# EAGLE design LPC_smd_display_hor (EAGLE 5.03)
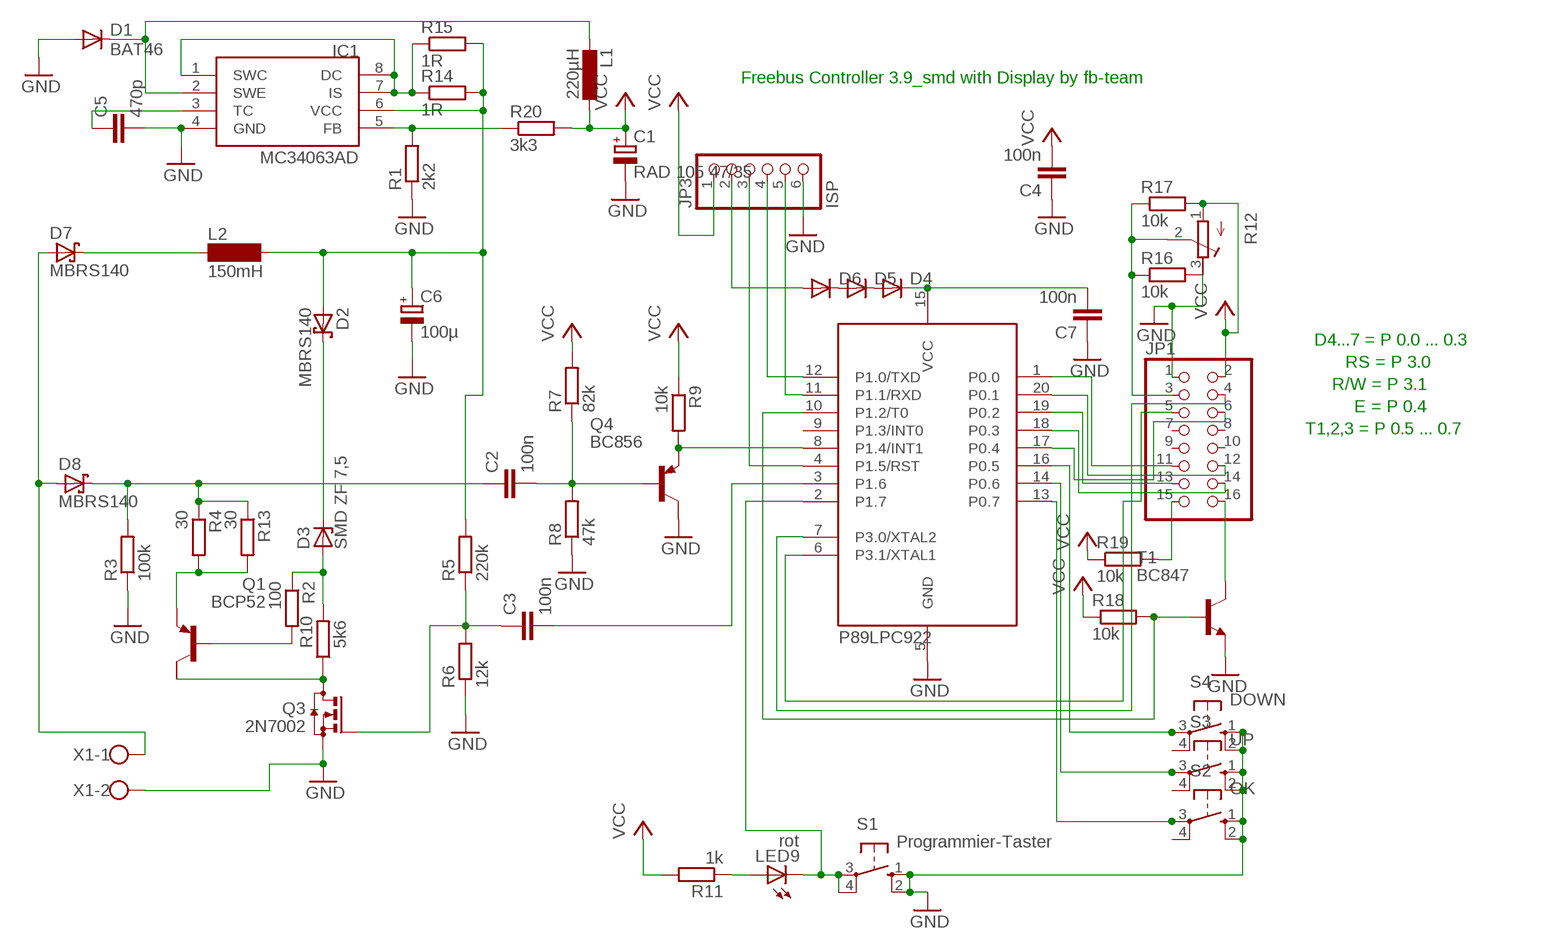
[diagram p0: schematic, sheet 1]

## Parts
C1  RAD 105 47/35  CPOL-EUE2-5  [E2-5]
C2  100n  C-EUC1206  [C1206]
C3  100n  C-EUC1206  [C1206]
C4  100n  C-EUC1206  [C1206]
C5  470p  C-EUC1206  [C1206]
C6  100µ  CPOL-EUE2.5-7  [E2,5-7]
C7  100n  C-EUC1206  [C1206]
D1  BAT46  DIODE-MINIMELF  [MINIMELF]
D2  MBRS140  MBRS130LT3  [SMB]
D3  SMD ZF 7,5  ZPD  [MINIMELF]
D4  DIODE-MINIMELF  [MINIMELF]
D5  DIODE-MINIMELF  [MINIMELF]
D6  DIODE-MINIMELF  [MINIMELF]
D7  MBRS140  MBRS130LT3  [SMB]
D8  MBRS140  MBRS130LT3  [SMB]
IC1  MC34063AD  [SOIC8]
JP1  PINHD-2X8  [2X08]
JP3  ISP  PINHD-1X6  [1X06]
L1  220µH  L-EU2200-11.43  [2200-11.43]
L2  150mH  SD12-1000  [SD12_1000]
LED9  rot  LED3MM  [LED3MM]
Q1  BCP52  FZT753SMD  [SOT223]
Q3  2N7002  BSS123  [SOT23]
Q4  BC856  BC856ALT1SMD  [SOT23-BEC]
R1  2k2  R-EU_R1206  [R1206]
R2  100  R-EU_M1206  [M1206]
R3  100k  R-EU_M1206  [M1206]
R4  30  R-EU_R1206  [R1206]
R5  220k  R-EU_R1206  [R1206]
R6  12k  R-EU_M1206  [M1206]
R7  82k  R-EU_R1206  [R1206]
R8  47k  R-EU_M1206  [M1206]
R9  10k  R-EU_R1206  [R1206]
R10  5k6  R-EU_M1206  [M1206]
R11  1k  R-EU_M1206  [M1206]
R12  R-TRIMM3374  [RTRIM3374]
R13  30  R-EU_R1206  [R1206]
R14  1R  R-EU_M1206  [M1206]
R15  1R  R-EU_M1206  [M1206]
R16  10k  R-EU_R1206  [R1206]
R17  10k  R-EU_R1206  [R1206]
R18  10k  R-EU_R1206  [R1206]
R19  10k  R-EU_R1206  [R1206]
R20  3k3  R-EU_M1206  [M1206]
S1  Programmier-Taster  10-XX  [B3F-10XX]
S2  OK  10-XX  [B3F-10XX]
S3  UP  10-XX  [B3F-10XX]
S4  DOWN  10-XX  [B3F-10XX]
T1  BC847  [SOT23]
U$1  P89LPC922_SMD  [SO20W]
X1  W237-02P  [W237-132]

## Nets
GND: C1.- C4.1 C5.2 C6.- C7.1 D1.A IC1.4(GND) JP1.1 JP3.6 Q3.2(S) Q4.C R1.1 R3.1 R6.1 R8.1 R12.3(A) R16.2 S1.1(S) S1.2(S1) S2.1(S) S2.2(S1) S3.1(S) S3.2(S1) S4.1(S) S4.2(S1) T1.2(E) U$1.5(GND) X1.2
N$1: Q4.E R9.2 U$1.8(P1.4/INT1)
N$2: C2.2 Q4.B R7.1 R8.2
N$3: IC1.5(FB) R1.2 R20.1
N$4: IC1.1(SWC) IC1.7(IS) IC1.8(DC) R14.1 R15.1
N$5: C3.2 U$1.3(P1.6)
N$6: Q1.2(C) Q3.3(D) R10.1
N$7: C6.+ D2.A IC1.6(VCC) L2.2 R5.2 R14.2 R15.2
N$8: D7.C L2.1
N$9: C2.1 D8.C R3.2 R4.1 R13.1
N$10: D1.C IC1.2(SWE) L1.2
N$11: D3.A R2.1 R10.2
N$12: Q1.3(E) R4.2 R13.2
N$13: C5.1 IC1.3(TC)
N$14: Q1.1(B) R2.2
N$15: JP1.11 U$1.1(P0.0)
N$16: D7.A D8.A X1.1
N$17: LED9.K(C) S1.3(P) S1.4(P1) U$1.2(P1.7)
N$18: JP1.12 U$1.20(P0.1)
N$19: JP1.13 U$1.19(P0.2)
N$20: JP1.3 R12.2(S) R16.1 R17.1
N$21: JP1.14 U$1.18(P0.3)
N$22: JP1.16 T1.3(C)
N$23: S4.3(P) U$1.16(P0.5)
N$24: R18.2 T1.1(B) U$1.10(P1.2/T0)
N$25: JP1.4 U$1.7(P3.0/XTAL2)
N$26: JP1.5 U$1.6(P3.1/XTAL1)
N$27: JP1.6 U$1.17(P0.4)
N$28: S3.3(P) U$1.14(P0.6)
N$29: JP3.4 U$1.12(P1.0/TXD)
N$30: JP3.5 U$1.11(P1.1/RXD)
N$31: JP3.3 U$1.4(P1.5/RST)
N$32: C7.2 D4.C U$1.15(VCC)
N$33: S2.3(P) U$1.13(P0.7)
N$34: C3.1 Q3.1(G) R5.1 R6.2
N$35: D4.A D5.C
N$36: JP1.15 R19.2
N$37: D6.A JP3.2
N$38: D5.A D6.C
N$40: D2.C D3.C
N$41: LED9.A R11.1
VCC: C1.+ C4.2 JP1.2 JP3.1 L1.1 R7.2 R9.1 R11.2 R12.1(E) R17.2 R18.1 R19.1 R20.2
Unconnected: JP1.7 JP1.8 JP1.9 JP1.10 Q1.4(C/) S2.4(P1) S3.4(P1) S4.4(P1) U$1.9(P1.3/INT0)

## Notes on the sheet
- Freebus Controller 3.9_smd with Display by fb-team
- D4...7 = P 0.0 ... 0.3
- RS = P 3.0
- R/W = P 3.1
- E = P 0.4
- T1,2,3 = P 0.5 ... 0.7
- P89LPC922

## Library data of the parts
C1 C6 = rcl:CPOL-EU: POLARIZED CAPACITOR, European symbol
C2-C5 C7 = rcl:C-EU: CAPACITOR, European symbol
D1 D4-D6 = diode:DIODE-: DIODE
D2 D7 D8 = diode:MBRS130LT3: Schottky Power Rectifier Source: http://www.onsemi.com/pub/Collateral/MBRS130LT3-D.PDF
D3 = diode:ZPD: Z DIODE 500 mW
IC1 = mc34063:MC34063
JP1 = pinhead:PINHD-2X8: PIN HEADER
JP3 = pinhead:PINHD-1X6: PIN HEADER
L1 = rcl:L-EU: INDUCTOR, European symbol
L2 = inductor-neosid:SD12: INDUCTOR nominal inductance
LED9 = led:LED: LED OSRAM: - CHIPLED LG R971, LG N971, LY N971, LG Q971, LY Q971, LO R971, LY R971 LH N974, LH R974 LS Q976, LO Q976, LY Q976 LO Q996 - Hyper CHIPLED LW Q18S LB Q993, LB Q99A, LB R99A - SideLED LS A670, LO A670, LY A670, LG A670, LP A670 LB A673, LV A673, LT A673, LW A673 LH A674 LY A675 LS A676, LA A676, LO A676, LY A676, LW A676 LS A679, LY A679, LG A679 - Hyper Micro SIDELED® LS Y876, LA Y876, LO Y876, LY Y876 LT Y87S - SmartLED LW L88C, LW L88S LB L89C, LB L89S, LG L890 LS L89K, LO L89K, LY L89K LS L896, LA L896, LO L896, LY L896 - TOPLED LS T670, LO T670, LY T670, LG T670, LP T670 LSG T670, LSP T670, LSY T670, LOP T670, LYG T670 LG T671, LOG T671, LSG T671 LB T673, LV T673, LT T673, LW T673 LH T674 LS T676, LA T676, LO T676, LY T676, LB T676, LH T676, LSB T676, LW T676 LB T67C, LV T67C, LT T67C, LS T67K, LO T67K, LY T67K, LW E67C LS E67B, LA E67B, LO E67B, LY E67B, LB E67C, LV E67C, LT E67C LW T67C LS T679, LY T679, LG T679 LS T770, LO T770, LY T770, LG T770, LP T770 LB T773, LV T773, LT T773, LW T773 LH T774 LS E675, LA E675, LY E675, LS T675 LS T776, LA T776, LO T776, LY T776, LB T776 LHGB T686 LT T68C, LB T68C - Hyper Mini TOPLED® LB M676 - Mini TOPLED Santana® LG M470 LS M47K, LO M47K, LY M47K Source: http://www.osram.convergy.de - LUMILED® LXK2-PW12-R00, LXK2-PW12-S00, LXK2-PW14-U00, LXK2-PW14-V00 LXK2-PM12-R00, LXK2-PM12-S00, LXK2-PM14-U00 LXK2-PE12-Q00, LXK2-PE12-R00, LXK2-PE12-S00, LXK2-PE14-T00, LXK2-PE14-U00 LXK2-PB12-K00, LXK2-PB12-L00, LXK2-PB12-M00, LXK2-PB14-N00, LXK2-PB14-P00, LXK2-PB14-Q00 LXK2-PR12-L00, LXK2-PR12-M00, LXK2-PR14-Q00, LXK2-PR14-R00 LXK2-PD12-Q00, LXK2-PD12-R00, LXK2-PD12-S00 LXK2-PH12-R00, LXK2-PH12-S00 LXK2-PL12-P00, LXK2-PL12-Q00, LXK2-PL12-R00 Source: www.luxeon.com
Q1 = transistor-pnp:FZT753SMD: PNP Transistor
Q3 = transistor-small-signal:BSS123: N-CHANNEL MOS FET
Q4 = transistor-pnp:BC856*: PNP Transistror
R1-R11 R13-R20 = rcl:R-EU_: RESISTOR, European symbol
R12 = rcl:R-TRIMM: Trimm resistor
S1-S4 = switch-omron:10-XX: OMRON SWITCH
T1 = transistor:BC847: NPN TRANSISTOR
U$1 = micro-philips:P89LPC922_SMD
X1 = con-wago-508:W237-02P: WAGO SREW CLAMP

## Board
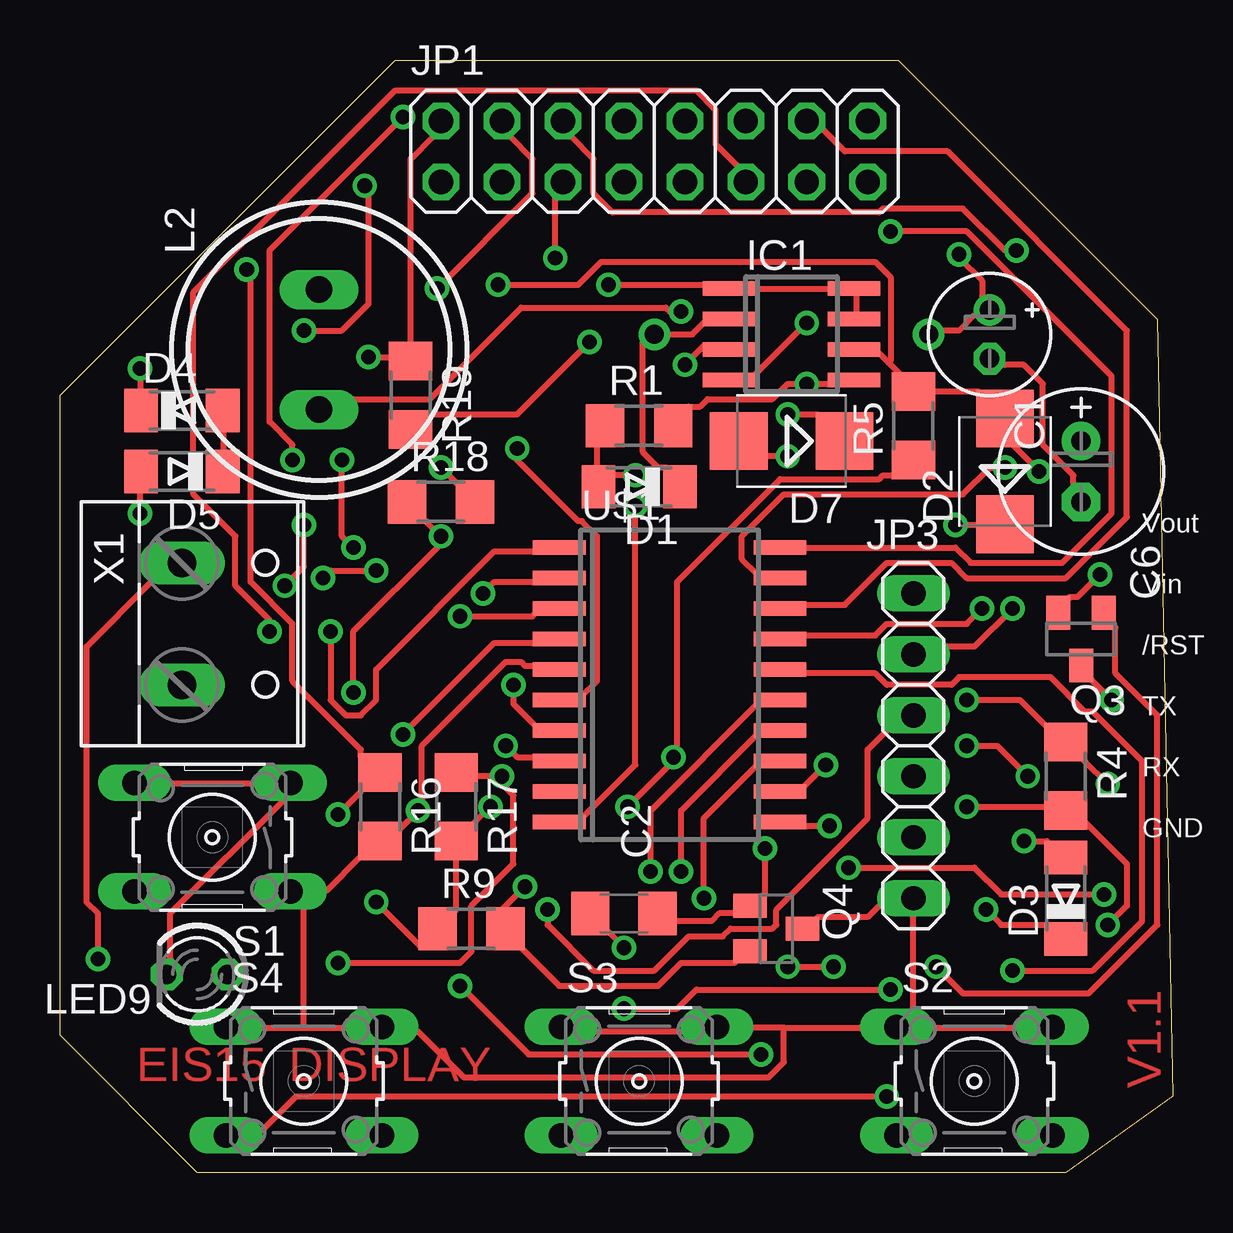
[diagram p1: board, top side]
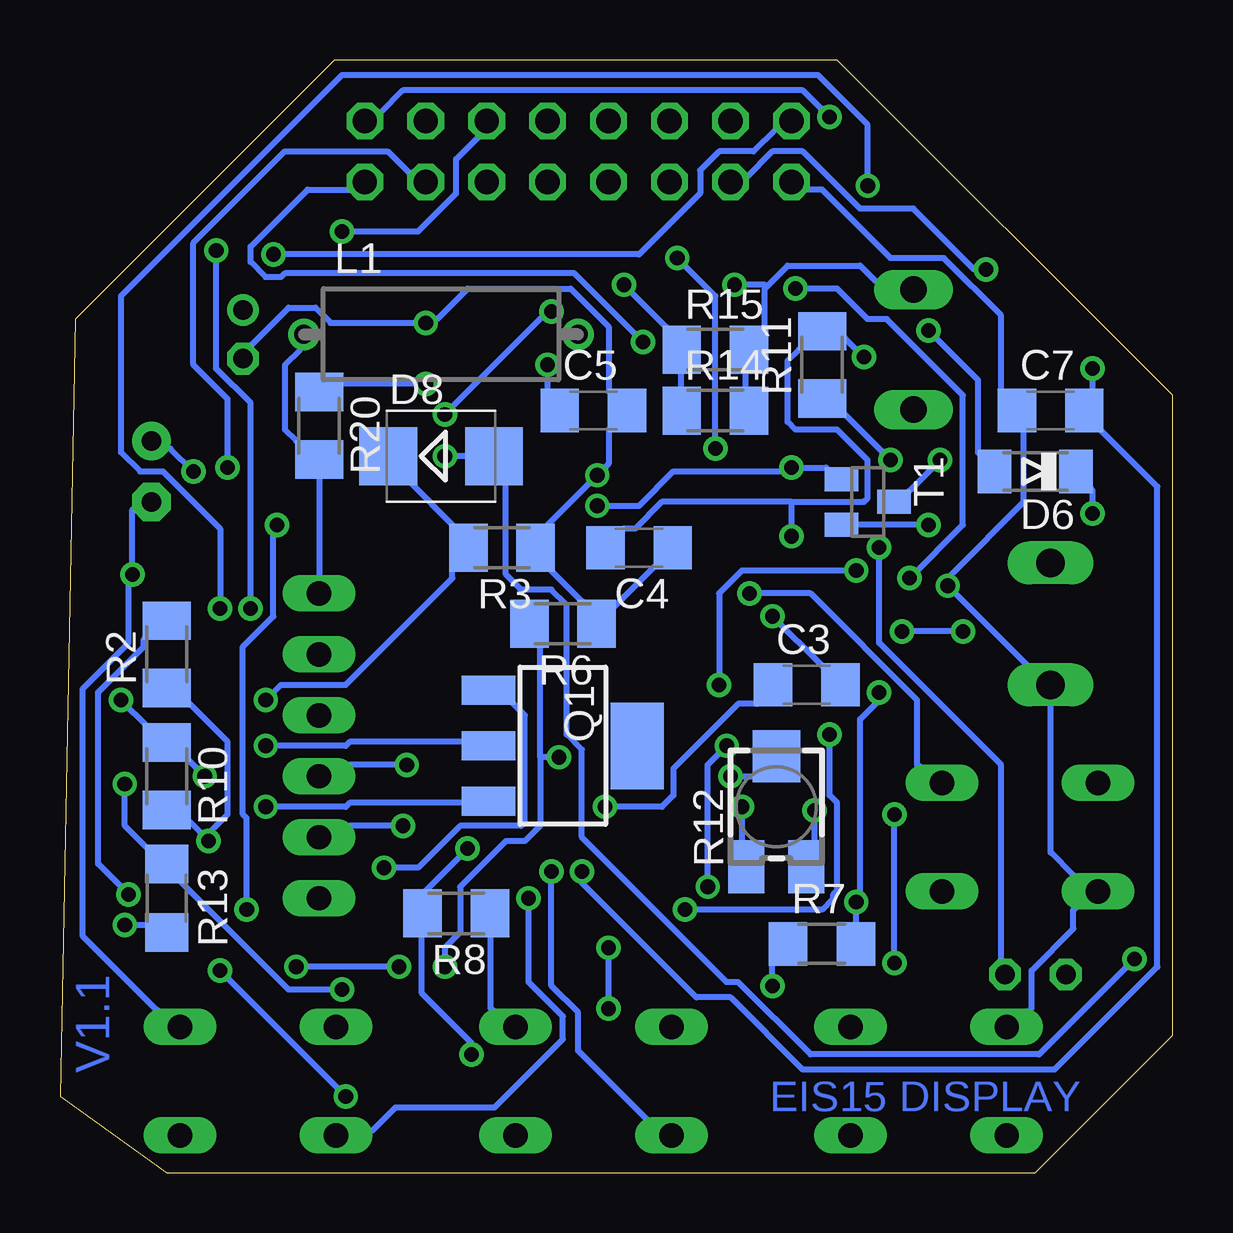
[diagram p2: board, bottom side, seen from below]

Size 46.35 x 46.36 mm. Coordinates in mm from the lower left corner, seen from the top.
Outline: 0,5.71 0,32.39 13.97,46.36 34.92,46.36 45.72,35.56 46.35,3.18 41.91,0 5.71,0 0,5.71
Copper layers (1*16): Top 0.035mm / dielectric 1.5mm / Bottom 0.035mm
Design rules "default *": minimum track width 10mil, minimum drill 24mil, track to track 10mil, track to pad 10mil, pad to pad 10mil, via to via 10mil, smd to smd 8mil, copper to edge 20mil, drill to drill 8mil, minimum pad ring 10mil, minimum via ring 8mil, stop-mask expansion 4mil, vias tented up to drill 0mil, thermal gap 10mil

### Footprints (pad centres in the part's own frame; a part is rotated, then mirrored left to right if it is on the bottom)
E2-5 = drill 0.813 pad 1.27 round: + -1.016,0 | drill 0.813 pad 1.27 octagon: - 1.016,0
C1206 = smd 1.6 x 1.8: 1 -1.4,0; 2 1.4,0
E2,5-7 = drill 0.813 pad 1.6 round: + -1.27,0 | drill 0.813 pad 1.6 octagon: - 1.27,0
MINIMELF = smd 1.4 x 1.8: A 1.7,0; C -1.7,0
SMB = smd 2.4 x 2.4: A 2.2,0; C -2.2,0
SOIC8 = smd 0.6 x 2.2: 1 -1.905,-2.6; 2 -0.635,-2.6; 3 0.635,-2.6; 4 1.905,-2.6; 5 1.905,2.6; 6 0.635,2.6; 7 -0.635,2.6; 8 -1.905,2.6
2X08 = drill 1.016 octagon: 1 -8.89,-1.27; 2 -8.89,1.27; 3 -6.35,-1.27; 4 -6.35,1.27; 5 -3.81,-1.27; 6 -3.81,1.27; 7 -1.27,-1.27; 8 -1.27,1.27; 9 1.27,-1.27; 10 1.27,1.27; 11 3.81,-1.27; 12 3.81,1.27; 13 6.35,-1.27; 14 6.35,1.27; 15 8.89,-1.27; 16 8.89,1.27
1X06 = drill 1.016 long: 1 -6.35,0; 2 -3.81,0; 3 -1.27,0; 4 1.27,0; 5 3.81,0; 6 6.35,0
2200-11.43 = drill 0.8 pad 1.27 round: 1 -5.715,0; 2 5.715,0
SD12_1000 = drill 1.1 long: 1 -2.5,0; 2 2.5,0
LED3MM = drill 0.813 octagon: A -1.27,0; K 1.27,0
SOT223 = smd 1.219 x 2.235: 1 -2.311,-3.099; 2 0,-3.099; 3 2.311,-3.099 | smd 3.6 x 2.2: 4 0,3.099
SOT23 = smd 1 x 1.4: 1 -0.95,-1.1; 2 0.95,-1.1; 3 0,1.1
SOT23-BEC = smd 1 x 1.4: B -0.95,-1.1; C 0,1.1; E 0.95,-1.1
R1206 = smd 1.6 x 1.803: 1 -1.422,0; 2 1.422,0
M1206 = smd 1.6 x 2: 1 -1.4,0; 2 1.4,0
RTRIM3374 = smd 1.5 x 2.2: 1 -1.25,-2.5; 3 1.25,-2.5 | smd 1.98 x 2.17: 2 0,2.1
B3F-10XX = drill 1.016 long: 1 -3.251,2.261; 2 3.251,2.261; 3 -3.251,-2.261; 4 3.251,-2.261
SO20W = smd 0.6 x 2.2: 1 -5.715,-4.6; 2 -4.445,-4.6; 3 -3.175,-4.6; 4 -1.905,-4.6; 5 -0.635,-4.6; 6 0.635,-4.6; 7 1.905,-4.6; 8 3.175,-4.6; 9 4.445,-4.6; 10 5.715,-4.6; 11 5.715,4.6; 12 4.445,4.6; 13 3.175,4.6; 14 1.905,4.6; 15 0.635,4.6; 16 -0.635,4.6; 17 -1.905,4.6; 18 -3.175,4.6; 19 -4.445,4.6; 20 -5.715,4.6
W237-132 = drill 1.194 long: 1 -2.54,-0.635; 2 2.54,-0.635

### Placement (x,y rotation side)
C1  38.73,34.93 270 top
C2  23.5,10.79 0 top
C3  15.24,20.32 0 bottom
C4  22.23,26.03 180 bottom
C5  24.13,31.75 0 bottom
C6  42.54,29.21 270 top
C7  5.08,31.75 0 bottom
D1  24.13,28.58 180 top
D2  39.37,29.21 90 top
D3  41.91,11.43 90 top
D4  5.08,31.75 0 top
D5  5.08,29.21 180 top
D6  5.71,29.21 180 bottom
D7  30.48,30.48 180 top
D8  30.48,29.84 0 bottom
IC1  30.48,34.93 270 top
JP1  24.77,42.55 0 top
JP3  35.56,17.78 270 top
L1  30.48,34.93 0 bottom
L2  10.79,34.29 90 top
LED9  5.71,8.26 180 top
Q1  25.4,17.78 270 bottom
Q3  42.54,22.23 180 top
Q4  29.85,10.16 270 top
R1  24.13,31.12 0 top
R2  41.91,21.59 90 bottom
R3  27.94,26.03 180 bottom
R4  41.91,16.51 270 top
R5  35.56,31.12 90 top
R6  25.4,22.86 180 bottom
R7  14.61,9.53 0 bottom
R8  29.85,10.79 180 bottom
R9  17.15,10.16 0 top
R10  41.91,16.51 270 bottom
R11  14.61,33.66 90 bottom
R12  16.51,15.24 0 bottom
R13  41.91,11.43 270 bottom
R14  19.05,31.75 0 bottom
R15  19.05,34.29 0 bottom
R16  13.33,15.24 270 top
R17  16.51,15.24 270 top
R18  15.88,27.94 0 top
R19  14.61,32.39 270 top
R20  35.56,31.12 270 bottom
S1  6.35,13.97 180 top
S2  38.1,3.81 0 top
S3  24.13,3.81 0 top
S4  10.16,3.81 0 top
T1  12.7,27.94 270 bottom
U$1  25.4,20.32 270 top
X1  5.71,22.86 270 top

### Tracks (layer width: path | path; a pad name or v marks a point on that pad's centre or on a via)
GND  (via drill 0.61)
  Top 0.254: v10.16,26.99 10.16,25.24 v9.37,24.45 | R1.1 22.38,30.32 22.38,29.37 D1.A 23.02,29.05 v23.97,29.05 | v43.34,24.92 42.39,23.97 42.07,23.97 Q3.2 | v31.12,35.4 28.89,33.18 IC1.4 | C6.- 42.23,28.73 42.23,29.05 40.96,30.32 40.96,32.86 40.16,33.66 39.37,33.66 C1.- | S3.1 22.38,5.87 25.88,5.87 S3.2 28.89,6.03 30.16,6.03 | Q4.C 31.59,10.64 33.66,10.64 34.13,11.11 JP3.6 35.56,6.83 S2.1 | S2.1 36.35,6.03 39.85,6.03 S2.2 | 30.16,6.03 33.34,6.03 S2.1 | 10.16,6.03 11.91,6.03 S4.2 14.92,5.87 16.83,3.97 29.53,3.97 30.16,4.6 30.16,6.03 | 10.16,6.03 8.41,6.03 S4.1 | U$1.5 19.84,21.11 19.37,21.11 19.21,21.27 18.57,21.27 15.08,17.78 15.08,15.56 v14.92,15.08 14.13,14.29 R16.2 12.54,13.18 11.11,11.75 S1.1 10.16,10.95 10.16,6.03
  Bottom 0.254: v10.16,26.99 13.18,26.99 T1.2 | JP1.1 15.24,40.96 14.61,40.96 11.75,38.1 9.53,38.1 7.14,35.72 7.14,32.54 C7.1 6.19,30.96 6.19,27.94 9.21,24.92 v9.37,24.45 6.03,21.11 X1.2 5.08,13.33 4.13,12.38 S1.2 4.13,10.95 4.13,10.16 5.87,8.41 5.87,6.83 S4.1 | C4.1 21.59,25.24 23.34,23.49 R6.1 24.61,23.81 25.88,25.08 R3.1 26.04,26.99 v23.97,29.05 23.5,29.53 23.5,30.96 C5.2 23.5,32.54 23.5,35.24 25.08,36.83 29.37,36.83 30.64,35.56 v31.12,35.4 35.08,35.4 35.72,36.04 36.83,36.04 38.42,34.45 C1.- | C6.- 43.34,27.62 v43.34,24.92 43.5,24.45 43.5,22.07 45.4,20.16 45.4,9.84 42.39,6.83 S2.2 | R8.1 28.42,9.84 28.42,6.83 S3.2 | v14.92,15.08 14.92,13.81 R12.3
N$1  (via drill 0.61)
  Top 0.254: Q4.E 28.1,8.73 25.88,8.73 24.92,7.78 20.8,7.78 19.21,9.37 R9.2 18.42,10.95 v19.37,11.91 | v18.57,17.78 19.05,17.3 19.84,17.3 U$1.8
  Bottom 0.254: v18.57,17.78 19.37,16.99 v19.37,11.91
N$2  (via drill 0.61)
  Top 0.254: C2.2 25.56,10.48 27.15,10.48 27.46,10.79 28.1,10.79 Q4.B 29.37,11.59 v29.37,13.49 | v16.67,7.78 19.53,4.92 v29.21,4.92
  Bottom 0.254: v16.67,7.78 16.67,8.73 R7.1 | v29.21,4.92 29.21,5.4 31.27,7.46 31.27,9.84 R8.2 31.12,11.75 v29.37,13.49
N$3  (via drill 0.61)
  Top 0.254: R1.2 26.19,31.91 26.67,31.91 26.99,32.23 29.69,32.23 30.32,32.86 v31.12,32.86 32.07,32.86 IC1.5
  Bottom 0.254: v31.12,32.86 34.61,32.86 R20.1
N$4  (via drill 0.61)
  Top 0.254: IC1.7 33.18,35.72 33.18,36.67 IC1.8 32.07,36.83 28.89,36.83 IC1.1 26.83,36.99 v22.86,36.99
  Bottom 0.254: R14.1 20.48,32.7 20.48,33.34 R15.1 21.11,35.24 v22.86,36.99
N$5  (via drill 0.61)
  Top 0.254: v16.67,23.18 19.69,23.18 19.84,23.34 U$1.3
  Bottom 0.254: v16.67,23.18 14.61,21.11 C3.2
N$6  (via drill 0.61)
  Top 0.254: v43.81,19.69 43.02,20.48 Q3.3 | v37.78,17.78 39.05,17.78 v40.32,16.51
  Bottom 0.254: v43.81,19.69 42.7,18.57 R10.1 40.96,17.15 v40.32,16.51 | v37.78,17.78 34.45,17.78 34.29,17.94 29.53,17.94 Q1.2
N$7  (via drill 0.61)
  Top 0.254: 34.53,33.73 35.08,33.18 R5.2 36.35,32.54 38.26,32.54 D2.A 39.69,30.32 v40.8,29.21 | 34.53,33.73 34.13,34.13 IC1.6 | v18.26,36.99 21.59,36.99 22.54,37.94 33.97,37.94 34.61,37.31 34.61,33.81 34.53,33.73
  Bottom 0.254: R14.2 17.78,32.7 17.78,33.34 R15.2 16.99,35.24 16.99,36.83 16.91,36.91 | 16.91,36.91 16.03,37.78 13.02,37.78 12.38,37.15 L2.2 | v40.8,29.21 41.75,30.16 C6.+ | v18.26,36.99 16.99,36.99 16.91,36.91
N$8  (via drill 0.61)
  Top 0.254: v30.32,31.59 31.59,31.59 D7.C | v25.88,35.88 25.4,35.88 25.24,36.04 19.21,36.04 15.4,32.23 12.22,32.23 L2.1
  Bottom 0.254: v30.32,31.59 26.04,35.88 v25.88,35.88
N$9  (via drill 0.61)
  Top 0.254: v23.5,9.37 22.86,10 C2.1 | v23.5,6.83 25.72,6.83 26.51,7.62 v34.61,7.62 | v43.66,16.19 42.7,17.15 R4.1 41.12,18.57 40,19.69 v37.78,19.69
  Bottom 0.254: D8.C 31.75,28.73 30,26.99 R3.2 30,25.08 30,24.77 34.45,20.32 37.15,20.32 v37.78,19.69 | v23.5,6.83 v23.5,9.37 | v34.61,7.62 36.83,7.62 41.27,12.06 R13.1 42.7,13.49 43.66,14.45 v43.66,16.19
N$10
  Top 0.254: D1.C 25.24,29.37 24.92,29.37 24.29,30 24.29,34.61 L1.2 25.4,34.93 26.35,34.93 26.83,35.4 IC1.2
N$11  (via drill 0.61)
  Top 0.254: v40.16,13.81 41.12,13.81 D3.A
  Bottom 0.254: R10.2 40.96,14.6 v40.16,13.81 40,14.29 39.37,14.92 39.37,17.94 40.96,19.53 R2.1
N$12  (via drill 0.61)
  Top 0.254: v43.66,10.32 44.45,11.11 44.45,12.86 42.7,14.6 R4.2 41.12,15.24 v37.78,15.24
  Bottom 0.254: v43.66,10.32 42.7,10.32 R13.2 | v37.78,15.24 34.45,15.24 34.29,15.4 29.53,15.4 Q1.3
N$13  (via drill 0.61)
  Top 0.254: v26.04,33.66 26.83,34.45 IC1.3
  Bottom 0.254: v26.04,33.66 26.04,32.54 C5.1
N$14  (via drill 0.61)
  Top 0.254: v43.5,11.59 39.21,11.59 38.1,12.7 v32.86,12.7
  Bottom 0.254: v43.5,11.59 44.77,12.86 44.77,20 42.86,21.91 42.86,22.23 R2.2 | v32.86,12.7 31.43,12.7 29.69,14.45 27.15,14.45 26.99,14.6 26.99,19.05 27.46,19.53 Q1.1
N$15  (via drill 0.61)
  Top 0.254: v11.27,22.54 11.27,19.69 11.91,19.05 12.54,19.05 13.18,19.69 13.18,20.95 18.1,25.88 19.84,25.88 U$1.1 | v8.73,22.54 8.73,23.02 7.3,24.45 7.3,26.51 5.56,28.26 5.56,36.67 13.97,45.09 26.51,45.09 27.31,44.29 27.31,42.86 28.26,41.91 JP1.11
  Bottom 0.254: v8.73,22.54 v11.27,22.54
N$16  (via drill 0.61)
  Top 0.254: v30.32,29.84 29.37,29.84 D7.A | v1.59,8.89 1.59,10.79 1.11,11.27 1.11,21.91 3.81,24.61 X1.1
  Bottom 0.254: v30.32,29.84 29.37,29.84 D8.A 27.78,28.73 27.78,24.92 27.15,24.29 25.88,24.29 25.24,23.65 25.24,18.26 24.61,17.62 24.61,13.97 18.57,7.94 18.1,7.94 15.08,4.92 5.56,4.92 v1.59,8.89
N$17  (via drill 0.61)
  Top 0.254: v17.62,24.13 18.1,24.61 19.84,24.61 U$1.2 | LED9.K 4.6,8.89 4.6,10.79 9.37,15.56 S1.3 8.1,16.19 4.6,16.19 S1.4
  Bottom 0.254: v17.62,24.13 15.08,24.13 10.64,19.69 10.64,16.99 S1.3
N$18  (via drill 0.61)
  Top 0.254: v34.61,39.21 37.78,39.21 43.81,33.18 43.81,27.46 41.75,25.4 37.94,25.4 37.31,26.03 30.96,26.03 U$1.20
  Bottom 0.254: v34.61,39.21 31.43,39.21 29.85,40.8 29.85,42.23 28.89,43.18 JP1.12
N$19  (via drill 0.61)
  Top 0.254: v39.37,29.37 38.73,29.37 37.62,28.26 30.16,28.26 28.42,26.51 28.42,25.56 29.05,24.92 U$1.19
  Bottom 0.254: v39.37,29.37 39.37,32.23 40.8,33.66 40.8,38.73 36.99,42.55 32.7,42.55 31.75,41.59 JP1.13
N$20  (via drill 0.61)
  Top 0.254: R17.1 17.3,16.51 v18.42,16.51 18.57,16.03 18.89,15.72 18.89,12.86 17.15,11.11 17.15,9.21 16.67,8.73 v11.59,8.73 | v7.78,37.62 7.94,37.47 7.94,24.61 9.68,22.86 9.68,20.48 12.54,17.62 12.54,17.3 R16.1 12.54,15.87 v11.59,14.92
  Bottom 0.254: v18.42,16.51 17.46,16.51 R12.2 | v7.78,37.62 8.26,37.62 10.79,40.16 13.02,40.16 15.4,42.55 16.67,42.55 17.78,41.43 JP1.3 | v11.59,8.73 v11.59,14.92
N$21
  Top 0.254: U$1.18 30.96,23.65 32.7,23.65 34.45,25.4 37.15,25.4 37.78,24.77 41.91,24.77 44.45,27.3 44.45,35.08 36.99,42.55 32.7,42.55 31.75,43.5 JP1.14
N$22  (via drill 0.61)
  Top 0.254: v9.68,29.69 9.68,30.32 8.73,31.27 8.73,38.42 v14.29,43.97
  Bottom 0.254: v9.68,29.69 10.95,28.42 T1.3 | v14.29,43.97 15.4,45.09 32.07,45.09 33.02,44.13 JP1.16
N$23  (via drill 0.61)
  Top 0.254: v39.69,8.41 43.02,8.41 45.09,10.48 45.09,17.15 43.02,19.21 42.7,19.21 41.27,20.64 37.46,20.64 37.15,20.32 34.45,20.32 33.97,20.8 30.96,20.8 U$1.16 | v34.45,3.18 9.84,3.18 8.41,1.75 S4.3
  Bottom 0.254: v34.45,3.18 v39.69,8.41
N$24  (via drill 0.61)
  Top 0.254: v15.88,29.37 16.51,28.73 R18.2 | v23.97,27.78 23.97,16.99 21.75,14.76 U$1.10
  Bottom 0.254: T1.1 14.45,29.37 v15.88,29.37 16.35,29.21 20.8,29.21 22.23,27.78 v23.97,27.78
N$25  (via drill 0.61)
  Top 0.254: v18.89,20.32 18.89,19.53 19.84,18.57 U$1.7 | v13.18,25.08 11.27,25.08 v10.95,24.77 | v15.72,36.83 19.69,40.8 19.69,42.23 18.73,43.18 JP1.4
  Bottom 0.254: v18.89,20.32 18.89,24.13 17.94,25.08 v13.18,25.08 | v10.95,24.77 8.73,26.99 8.73,32.39 11.91,35.56 12.7,35.56 13.97,36.83 v15.72,36.83
N$26  (via drill 0.61)
  Top 0.254: v19.05,30.16 19.05,29.69 21.59,27.15 21.75,27.15 22.38,26.51 22.38,20.48 21.75,19.84 U$1.6 | v20.64,38.1 20.64,40.64 JP1.5
  Bottom 0.254: v19.05,30.16 19.05,36.51 v20.64,38.1
N$27  (via drill 0.61)
  Top 0.254: v38.42,23.49 37.78,22.86 34.45,22.86 33.97,22.38 30.96,22.38 U$1.17 | v39.85,38.42 39.37,38.42 37.62,40.16 34.29,40.16 34.13,40.01 23.02,40.01 22.23,40.8 22.23,42.23 21.27,43.18 JP1.6
  Bottom 0.254: v38.42,23.49 38.42,32.07 39.85,33.5 v39.85,38.42
N$28  (via drill 0.61)
  Top 0.254: v25.88,12.54 25.88,15.08 29.05,18.26 U$1.14
  Bottom 0.254: v25.88,12.54 25.88,7.78 24.77,6.67 24.77,5.08 21.91,2.22 S3.3
N$29  (via drill 0.61)
  Top 0.254: v31.91,16.99 30.96,16.03 U$1.12
  Bottom 0.254: v31.91,16.99 34.29,16.99 JP3.4
N$30  (via drill 0.61)
  Top 0.254: v32.07,14.45 30.96,14.45 U$1.11
  Bottom 0.254: v32.07,14.45 34.29,14.45 JP3.5
N$31  (via drill 0.61)
  Top 0.254: v14.29,18.26 18.1,22.07 19.84,22.07 U$1.4 | v20.32,10.95 20.32,10.32 22.23,8.41 24.77,8.41 26.19,9.84 27.62,9.84 27.94,10.16 29.69,10.16 29.85,10.32 29.85,10.95 33.66,14.76 33.66,17.62 34.45,18.41 JP3.3
  Bottom 0.254: v14.29,18.26 14.29,15.72 13.97,15.4 13.97,11.75 14.13,11.59 14.13,11.43 14.61,10.95 v20.32,10.95
N$32  (via drill 0.61)
  Top 0.254: v3.33,33.5 3.33,32.54 D4.C | v24.61,12.54 24.61,15.08 29.05,19.53 U$1.15
  Bottom 0.254: v3.33,33.5 3.33,32.54 C7.2 3.02,30.96 0.64,28.58 0.64,8.57 4.92,4.29 15.4,4.29 18.42,7.3 19.84,7.3 24.61,12.06 v24.61,12.54
N$33  (via drill 0.61)
  Top 0.254: v26.83,11.43 26.83,14.76 29.05,16.99 U$1.13
  Bottom 0.254: v26.83,11.43 26.83,7.94 25.4,6.51 25.4,5.56 28.26,2.7 32.38,2.7 33.34,1.75 S2.3
N$34  (via drill 0.61)
  Top 0.254: v36.51,8.57 37.62,7.46 42.86,7.46 45.72,10.32 45.72,19.05 43.97,20.8 43.97,22.7 Q3.1 | v30.32,8.57 v32.23,8.57 | v23.65,15.24 25.56,17.15 v25.56,17.3 25.72,17.78 25.72,24.61 30,28.89 34.13,28.89 34.29,29.05 34.77,29.05 R5.1
  Bottom 0.254: v32.23,8.57 v36.51,8.57 | v30.32,8.57 30.32,9.37 29.69,10 29.69,11.91 27.78,13.81 26.99,13.81 26.35,14.45 26.35,17.3 | 26.35,17.3 26.35,21.91 R6.2 | v23.65,15.24 21.27,15.24 20.8,15.72 20.8,16.83 18.1,19.53 17.3,19.53 C3.1 | v25.56,17.3 26.35,17.3
N$35
  Top 0.254: D5.C 6.83,30 6.83,30.96 D4.A
N$36  (via drill 0.61)
  Top 0.254: v22.07,34.61 19.05,31.59 15.4,31.59 R19.2
  Bottom 0.254: v22.07,34.61 24.92,37.47 36.99,37.47 37.15,37.31 37.78,37.31 38.42,37.94 38.42,38.58 36.04,40.96 34.29,40.96 JP1.15
N$37  (via drill 0.61)
  Top 0.254: v10.16,35.08 11.75,35.08 12.86,36.2 12.86,40.96 v12.7,41.12 | v39.69,23.49 38.1,21.91 36.99,21.91 JP3.2
  Bottom 0.254: v10.16,35.08 8.1,33.02 8.1,30 D6.A | v12.7,41.12 12.7,43.66 14.76,45.72 34.61,45.72 43.81,36.51 43.81,30 43.02,29.21 42.07,29.21 39.69,26.83 v39.69,23.49
N$38  (via drill 0.61)
  Top 0.254: v3.33,27.46 3.33,28.42 D5.A
  Bottom 0.254: v3.33,27.46 3.33,28.42 D6.C
N$40  (via drill 0.61)
  Top 0.254: v38.58,10.95 39.21,10.32 41.12,10.32 D3.C | v37.31,26.99 38.26,26.99 D2.C
  Bottom 0.254: v38.58,10.95 38.58,14.76 38.73,14.92 38.73,21.91 37.46,23.18 37.46,26.83 v37.31,26.99
N$41  (via drill 0.61)
  Top 0.254: v11.75,29.69 11.75,26.51 v12.22,26.03
  Bottom 0.254: v11.75,29.69 13.65,31.59 R11.1 | v12.22,26.03 12.22,22.07 7.14,16.99 7.14,8.89 LED9.A
VCC  (via drill 0.61)
  Top 0.254: L1.1 36.83,35.08 37.46,35.08 38.1,35.72 C1.+ 38.42,36.51 38.42,37.15 37.46,38.1 v37.46,38.26 | JP1.2 15.56,43.18 14.61,42.23 R19.1 13.81,33.97 v12.86,33.97 | v13.18,11.27 15.08,9.37 R9.1 16.51,10.95 R17.2 17.3,14.6 v17.94,15.24 | R18.1 15.24,27.15 v15.88,26.51 15.72,26.03 12.22,22.54 v12.22,20
  Bottom 0.254: JP3.1 R20.2 36.51,30.48 36.99,30.96 36.99,33.66 36.35,34.29 L1.1 | R7.2 13.18,10.32 v13.18,11.27 13.02,11.75 13.02,18.89 12.22,19.69 v12.22,20 | v17.94,15.24 17.94,13.81 R12.1 | 15.88,27.94 12.86,27.94 12.7,28.1 12.7,29.69 13.97,30.96 15.72,30.96 16.03,31.27 16.03,33.81 15.56,34.29 R11.2 13.65,34.77 v12.86,33.97 | 15.88,27.94 21.27,27.94 22.38,26.83 22.86,26.83 C4.2 | v15.88,26.51 15.88,27.94 | v37.46,38.26 22.23,38.26 19.69,40.8 19.69,41.75 18.89,42.55 17.46,42.55 16.51,43.5 JP1.2

### Text on the board
Top: V1.1 | EIS15 | DISPLAY
Bottom: V1.1 | EIS15 DISPLAY
tPlace: Vout | Vin | /RST | TX | RX | GND